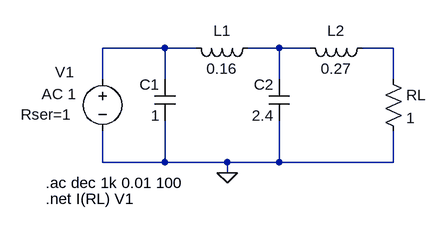
[diagram p0: schematic ej1_c.asc]
ej1_c.asc, the LTspice schematic file:
Version 4
SHEET 1 880 680
WIRE 112 112 16 112
WIRE 160 112 112 112
WIRE 288 112 240 112
WIRE 336 112 288 112
WIRE 464 112 416 112
WIRE 16 160 16 112
WIRE 112 160 112 112
WIRE 288 160 288 112
WIRE 464 160 464 112
WIRE 16 288 16 240
WIRE 112 288 112 224
WIRE 112 288 16 288
WIRE 208 288 112 288
WIRE 288 288 288 224
WIRE 288 288 208 288
WIRE 464 288 464 240
WIRE 464 288 288 288
WIRE 208 304 208 288
FLAG 208 304 0
SYMBOL voltage 16 144 R0
WINDOW 0 -73 5 Left 2
WINDOW 123 -94 39 Left 2
WINDOW 39 -126 70 Left 2
SYMATTR InstName V1
SYMATTR Value ""
SYMATTR Value2 AC 1
SYMATTR SpiceLine Rser=1
SYMBOL cap 128 224 R180
WINDOW 0 24 56 Left 2
WINDOW 3 24 8 Left 2
SYMATTR InstName C1
SYMATTR Value 1
SYMBOL cap 304 224 R180
WINDOW 0 24 56 Left 2
WINDOW 3 24 8 Left 2
SYMATTR InstName C2
SYMATTR Value 2.4
SYMBOL res 448 144 R0
SYMATTR InstName RL
SYMATTR Value 1
SYMBOL ind 256 96 R90
WINDOW 0 5 56 VBottom 2
WINDOW 3 32 56 VTop 2
SYMATTR InstName L1
SYMATTR Value 0.16
SYMBOL ind 432 96 R90
WINDOW 0 5 56 VBottom 2
WINDOW 3 32 56 VTop 2
SYMATTR InstName L2
SYMATTR Value 0.27
TEXT -72 320 Left 2 !.ac dec 1k 0.01 100
TEXT -72 344 Left 2 !.net I(RL) V1

The netlist it stands for:
* ej1_c.asc
V1 N001 0 AC 1 Rser=1
C1 0 N001 1
C2 0 N002 2.4
RL N003 0 1
L1 N002 N001 0.16
L2 N003 N002 0.27
.ac dec 1k 0.01 100
.net I(RL) V1
.backanno
.end